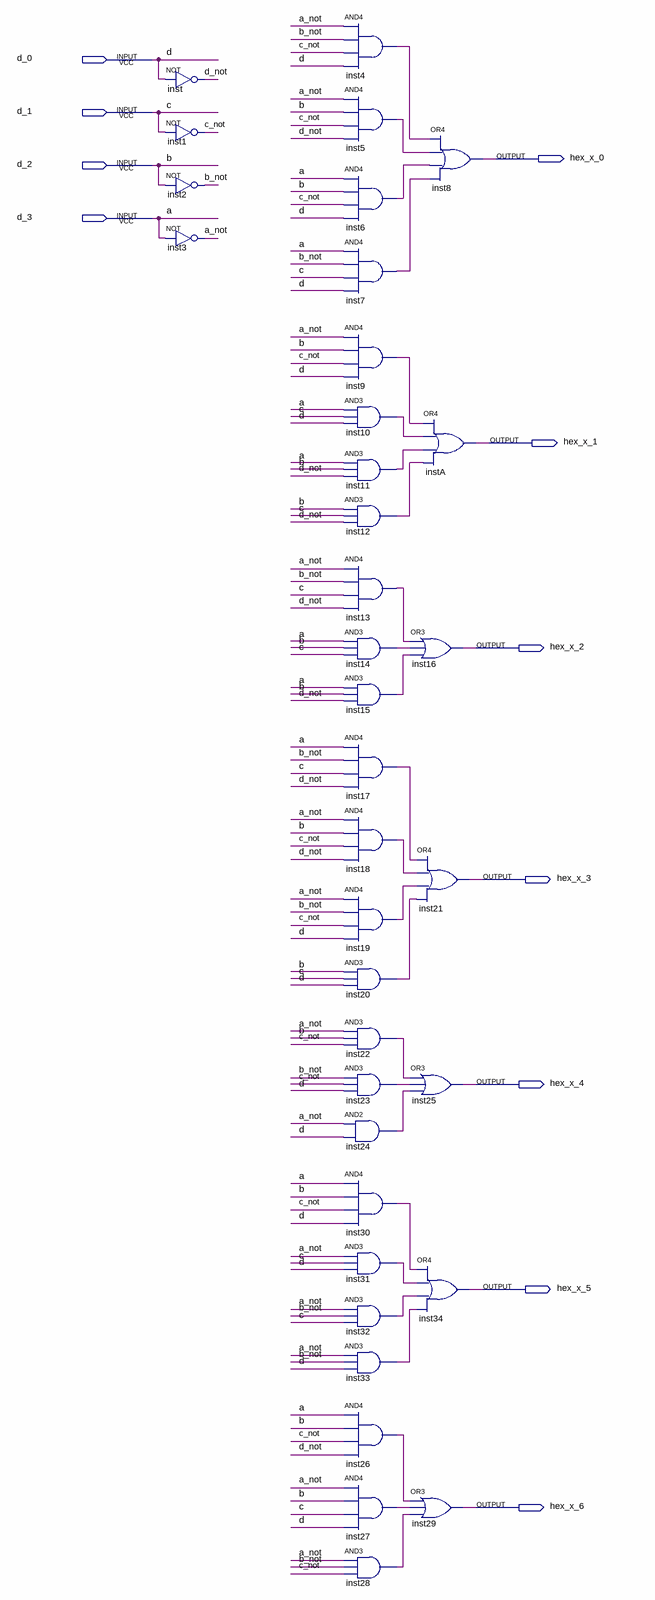
[diagram p0: schematic sheet]
// Quartus schematic display7seg.bdf as structural Verilog: 36 symbols, 11 pins
module display7seg (
  input  d_0,
  input  d_1,
  input  d_2,
  input  d_3,
  output hex_x_0,
  output hex_x_1,
  output hex_x_2,
  output hex_x_3,
  output hex_x_4,
  output hex_x_5,
  output hex_x_6
);

  wire a_not, b_not, c_not, d_not, inst4_out, inst5_out, inst6_out, inst7_out, inst9_out, inst10_out,
       inst11_out, inst12_out, inst13_out, inst14_out, inst15_out, inst17_out, inst18_out, inst19_out,
       inst20_out, inst22_out, inst23_out, inst24_out, inst26_out, inst27_out, inst28_out, inst30_out,
       inst31_out, inst32_out, inst33_out;

  not inst (d_not, d_0);
  not inst1 (c_not, d_1);
  not inst2 (b_not, d_2);
  not inst3 (a_not, d_3);
  and inst4 (inst4_out, a_not, b_not, c_not, d_0);
  and inst5 (inst5_out, a_not, d_2, c_not, d_not);
  and inst6 (inst6_out, d_3, d_2, c_not, d_0);
  and inst7 (inst7_out, d_3, b_not, d_1, d_0);
  and inst9 (inst9_out, a_not, d_2, c_not, d_0);
  and inst10 (inst10_out, d_3, d_1, d_0);
  and inst11 (inst11_out, d_3, d_2, d_not);
  and inst12 (inst12_out, d_2, d_1, d_not);
  and inst13 (inst13_out, a_not, b_not, d_1, d_not);
  and inst14 (inst14_out, d_3, d_2, d_1);
  and inst15 (inst15_out, d_3, d_2, d_not);
  and inst17 (inst17_out, d_3, b_not, d_1, d_not);
  and inst18 (inst18_out, a_not, d_2, c_not, d_not);
  and inst19 (inst19_out, a_not, b_not, c_not, d_0);
  and inst20 (inst20_out, d_2, d_1, d_0);
  and inst22 (inst22_out, a_not, d_2, c_not);
  and inst23 (inst23_out, b_not, c_not, d_0);
  and inst24 (inst24_out, a_not, d_0);
  and inst30 (inst30_out, d_3, d_2, c_not, d_0);
  and inst31 (inst31_out, a_not, d_1, d_0);
  and inst32 (inst32_out, a_not, b_not, d_1);
  and inst33 (inst33_out, a_not, b_not, d_0);
  and inst26 (inst26_out, d_3, d_2, c_not, d_not);
  and inst27 (inst27_out, a_not, d_2, d_1, d_0);
  and inst28 (inst28_out, a_not, b_not, c_not);
  or inst8 (hex_x_0, inst4_out, inst5_out, inst6_out, inst7_out);
  or instA (hex_x_1, inst9_out, inst10_out, inst11_out, inst12_out);
  or inst16 (hex_x_2, inst13_out, inst14_out, inst15_out);
  or inst21 (hex_x_3, inst17_out, inst18_out, inst19_out, inst20_out);
  or inst25 (hex_x_4, inst22_out, inst23_out, inst24_out);
  or inst34 (hex_x_5, inst30_out, inst31_out, inst32_out, inst33_out);
  or inst29 (hex_x_6, inst26_out, inst27_out, inst28_out);

  // Other names for the same wires on the sheet: d = d_0; c = d_1; b = d_2; a = d_3
endmodule
